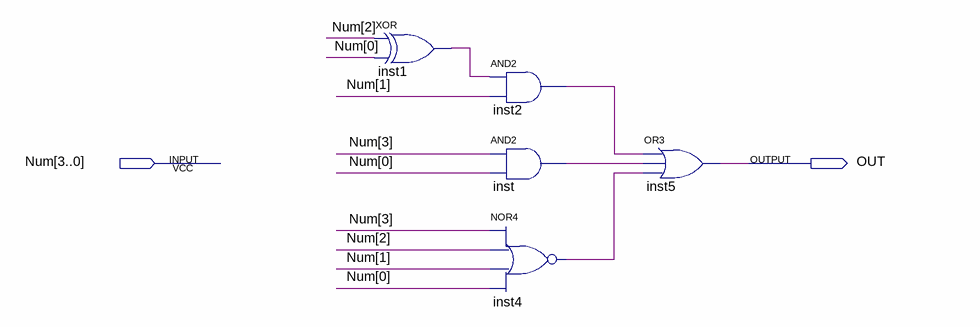
[diagram p0: schematic sheet]
// Quartus schematic Mod3.bdf as structural Verilog: 5 symbols, 2 pins
module Mod3 (
  input  [3:0] Num,
  output OUT
);

  wire inst1_out, inst2_out, inst4_out, inst_out;

  xor inst1 (inst1_out, Num[2], Num[0]);
  and inst2 (inst2_out, inst1_out, Num[1]);
  and inst (inst_out, Num[3], Num[0]);
  nor inst4 (inst4_out, Num[3], Num[2], Num[1], Num[0]);
  or inst5 (OUT, inst2_out, inst_out, inst4_out);
endmodule
